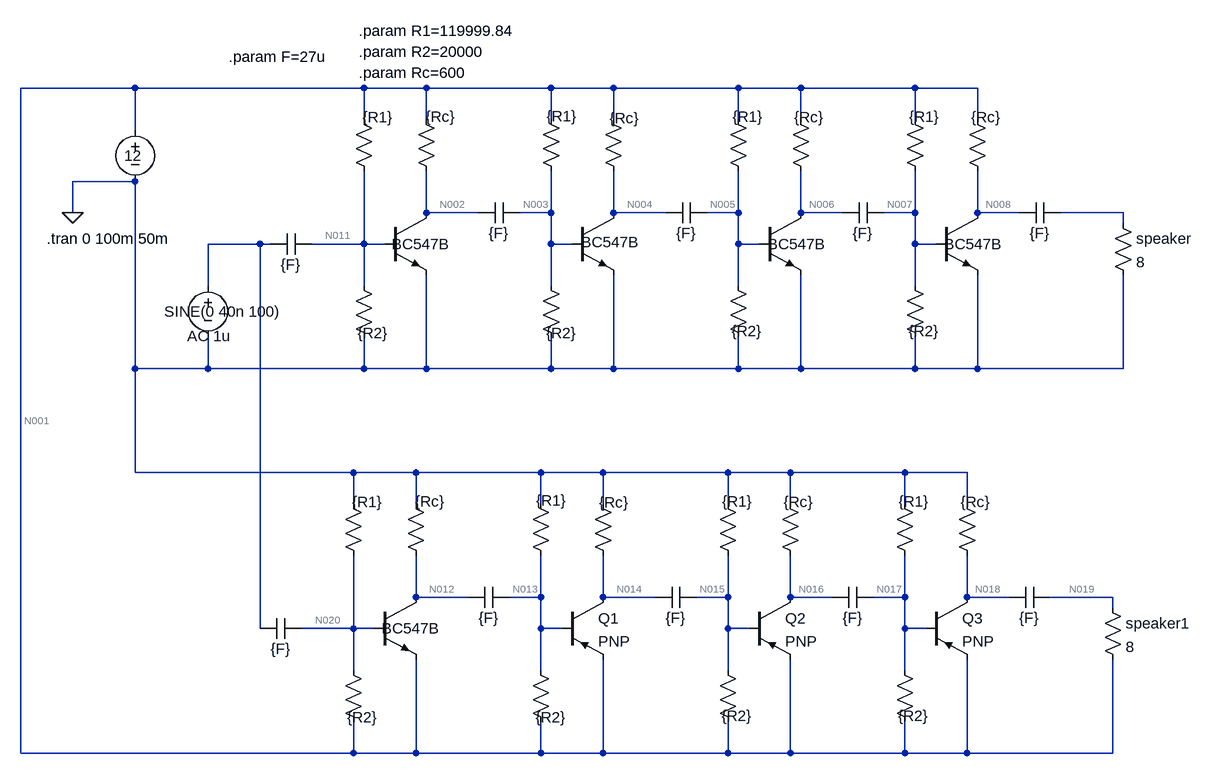
[diagram p0: schematic amplifier.asc]
amplifier.asc, the LTspice schematic file:
Version 4
SHEET 1 1988 1048
WIRE -336 16 -512 16
WIRE 16 16 -336 16
WIRE 112 16 16 16
WIRE 304 16 112 16
WIRE 400 16 304 16
WIRE 592 16 400 16
WIRE 688 16 592 16
WIRE 864 16 688 16
WIRE 960 16 864 16
WIRE 16 64 16 16
WIRE 112 64 112 16
WIRE 304 64 304 16
WIRE 400 64 400 16
WIRE 592 64 592 16
WIRE 688 64 688 16
WIRE 864 64 864 16
WIRE 960 64 960 16
WIRE -336 80 -336 16
WIRE -336 160 -432 160
WIRE -432 208 -432 160
WIRE 112 208 112 144
WIRE 192 208 112 208
WIRE 304 208 304 144
WIRE 304 208 256 208
WIRE 400 208 400 144
WIRE 480 208 400 208
WIRE 592 208 592 144
WIRE 592 208 544 208
WIRE 688 208 688 144
WIRE 752 208 688 208
WIRE 864 208 864 144
WIRE 864 208 816 208
WIRE 960 208 960 144
WIRE 1024 208 960 208
WIRE 1184 208 1088 208
WIRE 1184 224 1184 208
WIRE -144 256 -224 256
WIRE -128 256 -144 256
WIRE 16 256 16 144
WIRE 16 256 -64 256
WIRE 48 256 16 256
WIRE 304 256 304 208
WIRE 336 256 304 256
WIRE 592 256 592 208
WIRE 624 256 592 256
WIRE 864 256 864 208
WIRE 896 256 864 256
WIRE -224 320 -224 256
WIRE 16 320 16 256
WIRE 304 320 304 256
WIRE 592 320 592 256
WIRE 864 320 864 256
WIRE -336 448 -336 160
WIRE -224 448 -224 400
WIRE -224 448 -336 448
WIRE 16 448 16 400
WIRE 16 448 -224 448
WIRE 112 448 112 304
WIRE 112 448 16 448
WIRE 304 448 304 400
WIRE 304 448 112 448
WIRE 400 448 400 304
WIRE 400 448 304 448
WIRE 592 448 592 400
WIRE 592 448 400 448
WIRE 688 448 688 304
WIRE 688 448 592 448
WIRE 864 448 864 400
WIRE 864 448 688 448
WIRE 960 448 960 304
WIRE 960 448 864 448
WIRE 1184 448 1184 304
WIRE 1184 448 960 448
WIRE -336 608 -336 448
WIRE 0 608 -336 608
WIRE 96 608 0 608
WIRE 288 608 96 608
WIRE 384 608 288 608
WIRE 576 608 384 608
WIRE 672 608 576 608
WIRE 848 608 672 608
WIRE 944 608 848 608
WIRE 0 656 0 608
WIRE 96 656 96 608
WIRE 288 656 288 608
WIRE 384 656 384 608
WIRE 576 656 576 608
WIRE 672 656 672 608
WIRE 848 656 848 608
WIRE 944 656 944 608
WIRE 96 800 96 736
WIRE 176 800 96 800
WIRE 288 800 288 736
WIRE 288 800 240 800
WIRE 384 800 384 736
WIRE 464 800 384 800
WIRE 576 800 576 736
WIRE 576 800 528 800
WIRE 672 800 672 736
WIRE 736 800 672 800
WIRE 848 800 848 736
WIRE 848 800 800 800
WIRE 944 800 944 736
WIRE 1008 800 944 800
WIRE 1168 800 1072 800
WIRE 1168 816 1168 800
WIRE -144 848 -144 256
WIRE 0 848 0 736
WIRE 0 848 -80 848
WIRE 32 848 0 848
WIRE 288 848 288 800
WIRE 320 848 288 848
WIRE 576 848 576 800
WIRE 608 848 576 848
WIRE 848 848 848 800
WIRE 880 848 848 848
WIRE 0 912 0 848
WIRE 288 912 288 848
WIRE 576 912 576 848
WIRE 848 912 848 848
WIRE -512 1040 -512 16
WIRE 0 1040 0 992
WIRE 0 1040 -512 1040
WIRE 96 1040 96 896
WIRE 96 1040 0 1040
WIRE 288 1040 288 992
WIRE 288 1040 96 1040
WIRE 384 1040 384 896
WIRE 384 1040 288 1040
WIRE 576 1040 576 992
WIRE 576 1040 384 1040
WIRE 672 1040 672 896
WIRE 672 1040 576 1040
WIRE 848 1040 848 992
WIRE 848 1040 672 1040
WIRE 944 1040 944 896
WIRE 944 1040 848 1040
WIRE 1168 1040 1168 896
WIRE 1168 1040 944 1040
FLAG -432 208 0
SYMBOL npn 48 208 R0
WINDOW 0 56 32 Invisible 2
WINDOW 3 11 48 Left 2
SYMATTR InstName T1
SYMATTR Value BC547B
SYMBOL voltage -336 64 R0
WINDOW 0 24 16 Invisible 2
WINDOW 3 -17 56 Left 2
SYMATTR InstName V2
SYMATTR Value 12
SYMBOL res 0 48 R0
WINDOW 0 36 40 Invisible 2
WINDOW 3 14 13 Left 2
SYMATTR InstName R1
SYMATTR Value {R1}
SYMBOL res 0 304 R0
WINDOW 0 36 40 Invisible 2
WINDOW 3 6 89 Left 2
SYMATTR InstName R2
SYMATTR Value {R2}
SYMBOL res 96 48 R0
WINDOW 0 36 40 Invisible 2
WINDOW 3 15 12 Left 2
SYMATTR InstName Rc1
SYMATTR Value {Rc}
SYMBOL cap -128 272 R270
WINDOW 0 32 32 Invisible 2
WINDOW 3 0 32 VBottom 2
SYMATTR InstName C1
SYMATTR Value {F}
SYMBOL voltage -224 304 R0
WINDOW 123 -32 94 Left 2
WINDOW 3 -67 56 Left 2
WINDOW 0 24 16 Invisible 2
WINDOW 39 0 0 Left 0
SYMATTR Value2 AC 1u
SYMATTR Value SINE(0 40n 100)
SYMATTR InstName V1
SYMBOL res 1168 208 R0
SYMATTR InstName speaker
SYMATTR Value 8
SYMBOL cap 192 224 R270
WINDOW 0 32 32 Invisible 2
WINDOW 3 0 32 VBottom 2
SYMATTR InstName C2
SYMATTR Value {F}
SYMBOL npn 336 208 R0
WINDOW 0 56 32 Invisible 2
WINDOW 3 14 45 Left 2
SYMATTR InstName T2
SYMATTR Value BC547B
SYMBOL res 288 48 R0
WINDOW 0 36 40 Invisible 2
WINDOW 3 9 11 Left 2
SYMATTR InstName R3
SYMATTR Value {R1}
SYMBOL res 288 304 R0
WINDOW 0 36 40 Invisible 2
WINDOW 3 8 89 Left 2
SYMATTR InstName R4
SYMATTR Value {R2}
SYMBOL res 384 48 R0
WINDOW 0 36 40 Invisible 2
WINDOW 3 10 14 Left 2
SYMATTR InstName Rc2
SYMATTR Value {Rc}
SYMBOL cap 480 224 R270
WINDOW 0 32 32 Invisible 2
WINDOW 3 0 32 VBottom 2
SYMATTR InstName C3
SYMATTR Value {F}
SYMBOL npn 624 208 R0
WINDOW 0 56 32 Invisible 2
WINDOW 3 13 48 Left 2
SYMATTR InstName T3
SYMATTR Value BC547B
SYMBOL res 576 48 R0
WINDOW 0 36 40 Invisible 2
WINDOW 3 7 12 Left 2
SYMATTR InstName R5
SYMATTR Value {R1}
SYMBOL res 576 304 R0
WINDOW 0 36 40 Invisible 2
WINDOW 3 6 86 Left 2
SYMATTR InstName R6
SYMATTR Value {R2}
SYMBOL res 672 48 R0
WINDOW 0 36 40 Invisible 2
WINDOW 3 6 13 Left 2
SYMATTR InstName Rc3
SYMATTR Value {Rc}
SYMBOL cap 1024 224 R270
WINDOW 0 32 32 Invisible 2
WINDOW 3 0 32 VBottom 2
SYMATTR InstName C6
SYMATTR Value {F}
SYMBOL cap 752 224 R270
WINDOW 0 32 32 Invisible 2
WINDOW 3 0 32 VBottom 2
SYMATTR InstName C4
SYMATTR Value {F}
SYMBOL npn 896 208 R0
WINDOW 0 56 32 Invisible 2
WINDOW 3 13 48 Left 2
SYMATTR InstName T4
SYMATTR Value BC547B
SYMBOL res 848 48 R0
WINDOW 0 36 40 Invisible 2
WINDOW 3 7 12 Left 2
SYMATTR InstName R7
SYMATTR Value {R1}
SYMBOL res 848 304 R0
WINDOW 0 36 40 Invisible 2
WINDOW 3 6 86 Left 2
SYMATTR InstName R8
SYMATTR Value {R2}
SYMBOL res 944 48 R0
WINDOW 0 36 40 Invisible 2
WINDOW 3 6 13 Left 2
SYMATTR InstName Rc4
SYMATTR Value {Rc}
SYMBOL npn 32 800 R0
WINDOW 0 56 32 Invisible 2
WINDOW 3 11 48 Left 2
SYMATTR InstName T5
SYMATTR Value BC547B
SYMBOL res -16 640 R0
WINDOW 0 36 40 Invisible 2
WINDOW 3 14 13 Left 2
SYMATTR InstName R9
SYMATTR Value {R1}
SYMBOL res -16 896 R0
WINDOW 0 36 40 Invisible 2
WINDOW 3 6 89 Left 2
SYMATTR InstName R10
SYMATTR Value {R2}
SYMBOL res 80 640 R0
WINDOW 0 36 40 Invisible 2
WINDOW 3 15 12 Left 2
SYMATTR InstName Rc5
SYMATTR Value {Rc}
SYMBOL cap -144 864 R270
WINDOW 0 32 32 Invisible 2
WINDOW 3 0 32 VBottom 2
SYMATTR InstName C5
SYMATTR Value {F}
SYMBOL res 1152 800 R0
SYMATTR InstName speaker1
SYMATTR Value 8
SYMBOL cap 176 816 R270
WINDOW 0 32 32 Invisible 2
WINDOW 3 0 32 VBottom 2
SYMATTR InstName C7
SYMATTR Value {F}
SYMBOL res 272 640 R0
WINDOW 0 36 40 Invisible 2
WINDOW 3 9 11 Left 2
SYMATTR InstName R11
SYMATTR Value {R1}
SYMBOL res 272 896 R0
WINDOW 0 36 40 Invisible 2
WINDOW 3 8 89 Left 2
SYMATTR InstName R12
SYMATTR Value {R2}
SYMBOL res 368 640 R0
WINDOW 0 36 40 Invisible 2
WINDOW 3 10 14 Left 2
SYMATTR InstName Rc6
SYMATTR Value {Rc}
SYMBOL cap 464 816 R270
WINDOW 0 32 32 Invisible 2
WINDOW 3 0 32 VBottom 2
SYMATTR InstName C8
SYMATTR Value {F}
SYMBOL res 560 640 R0
WINDOW 0 36 40 Invisible 2
WINDOW 3 7 12 Left 2
SYMATTR InstName R13
SYMATTR Value {R1}
SYMBOL res 560 896 R0
WINDOW 0 36 40 Invisible 2
WINDOW 3 6 86 Left 2
SYMATTR InstName R14
SYMATTR Value {R2}
SYMBOL res 656 640 R0
WINDOW 0 36 40 Invisible 2
WINDOW 3 6 13 Left 2
SYMATTR InstName Rc7
SYMATTR Value {Rc}
SYMBOL cap 1008 816 R270
WINDOW 0 32 32 Invisible 2
WINDOW 3 0 32 VBottom 2
SYMATTR InstName C9
SYMATTR Value {F}
SYMBOL cap 736 816 R270
WINDOW 0 32 32 Invisible 2
WINDOW 3 0 32 VBottom 2
SYMATTR InstName C10
SYMATTR Value {F}
SYMBOL res 832 640 R0
WINDOW 0 36 40 Invisible 2
WINDOW 3 7 12 Left 2
SYMATTR InstName R15
SYMATTR Value {R1}
SYMBOL res 832 896 R0
WINDOW 0 36 40 Invisible 2
WINDOW 3 6 86 Left 2
SYMATTR InstName R16
SYMATTR Value {R2}
SYMBOL res 928 640 R0
WINDOW 0 36 40 Invisible 2
WINDOW 3 6 13 Left 2
SYMATTR InstName Rc8
SYMATTR Value {Rc}
SYMBOL pnp 320 800 R0
SYMATTR InstName Q1
SYMBOL pnp 608 800 R0
SYMATTR InstName Q2
SYMBOL pnp 880 800 R0
SYMATTR InstName Q3
TEXT -472 248 Left 2 !.tran 0 100m 50m
TEXT 8 -8 Left 2 !.param Rc=600
TEXT 8 -72 Left 2 !.param R1=119999.84
TEXT 8 -40 Left 2 !.param R2=20000
TEXT -192 -32 Left 2 !.param F=27u

The netlist it stands for:
* amplifier.asc
Q§T1 N002 N011 0 0 BC547B
V2 N001 0 12
R1 N001 N011 {R1}
R2 N011 0 {R2}
Rc1 N001 N002 {Rc}
C1 N010 N011 {F}
V1 N010 0 SINE(0 40n 100) AC 1u
R§speaker N009 0 8
C2 N002 N003 {F}
Q§T2 N004 N003 0 0 BC547B
R3 N001 N003 {R1}
R4 N003 0 {R2}
Rc2 N001 N004 {Rc}
C3 N004 N005 {F}
Q§T3 N006 N005 0 0 BC547B
R5 N001 N005 {R1}
R6 N005 0 {R2}
Rc3 N001 N006 {Rc}
C6 N008 N009 {F}
C4 N006 N007 {F}
Q§T4 N008 N007 0 0 BC547B
R7 N001 N007 {R1}
R8 N007 0 {R2}
Rc4 N001 N008 {Rc}
Q§T5 N012 N020 N001 0 BC547B
R9 0 N020 {R1}
R10 N020 N001 {R2}
Rc5 0 N012 {Rc}
C5 N010 N020 {F}
R§speaker1 N019 N001 8
C7 N012 N013 {F}
R11 0 N013 {R1}
R12 N013 N001 {R2}
Rc6 0 N014 {Rc}
C8 N014 N015 {F}
R13 0 N015 {R1}
R14 N015 N001 {R2}
Rc7 0 N016 {Rc}
C9 N018 N019 {F}
C10 N016 N017 {F}
R15 0 N017 {R1}
R16 N017 N001 {R2}
Rc8 0 N018 {Rc}
Q1 N014 N013 N001 0 PNP
Q2 N016 N015 N001 0 PNP
Q3 N018 N017 N001 0 PNP
.model NPN NPN
.model PNP PNP
.lib standard.bjt
.tran 0 100m 50m
.param Rc=600
.param R1=119999.84
.param R2=20000
.param F=27u
.backanno
.end

* Results of the author's LTspice run, read from the files saved beside the schematic
* Operating Point, zero values left out:
*   V(n002) = 2.773 V
*   V(n011) = 718.8 mV
*   V(n001) = 12 V
*   V(n003) = 718.8 mV
*   V(n004) = 2.773 V
*   V(n005) = 718.8 mV
*   V(n006) = 2.773 V
*   V(n008) = 2.773 V
*   V(n007) = 718.8 mV
*   V(n012) = 2.483 V
*   V(n020) = 3.15 V
*   V(n019) = 12 V
*   V(n013) = 11.18 V
*   V(n014) = 3.14 V
*   V(n015) = 11.18 V
*   V(n016) = 3.14 V
*   V(n018) = 3.14 V
*   V(n017) = 11.18 V
*   Ic(Q3) = -5.234 mA
*   Ib(Q3) = -52.34 µA
*   Ie(Q3) = 5.286 mA
*   Ic(Q2) = -5.234 mA
*   Ib(Q2) = -52.34 µA
*   Ie(Q2) = 5.286 mA
*   Ic(Q1) = -5.234 mA
*   Ib(Q1) = -52.34 µA
*   Ie(Q1) = 5.286 mA
*   Ic(T5) = -4.139 mA
*   Ib(T5) = 416.3 µA
*   Ie(T5) = 3.723 mA
*   Ic(T4) = 15.38 mA
*   Ib(T4) = 58.07 µA
*   Ie(T4) = -15.44 mA
*   Ic(T3) = 15.38 mA
*   Ib(T3) = 58.07 µA
*   Ie(T3) = -15.44 mA
*   Ic(T2) = 15.38 mA
*   Ib(T2) = 58.07 µA
*   Ie(T2) = -15.44 mA
*   Ic(T1) = 15.38 mA
*   Ib(T1) = 58.07 µA
*   Ie(T1) = -15.44 mA
*   I(Rc8) = -5.234 mA
*   I(R16) = -40.85 µA
*   I(R15) = -93.19 µA
*   I(Rc7) = -5.234 mA
*   I(R14) = -40.85 µA
*   I(R13) = -93.19 µA
*   I(Rc6) = -5.234 mA
*   I(R12) = -40.85 µA
*   I(R11) = -93.19 µA
*   I(Rc5) = -4.139 mA
*   I(R10) = -442.5 µA
*   I(R9) = -26.25 µA
*   I(Rc4) = 15.38 mA
*   I(R8) = 35.94 µA
*   I(R7) = 94.01 µA
*   I(Rc3) = 15.38 mA
*   I(R6) = 35.94 µA
*   I(R5) = 94.01 µA
*   I(Rc2) = 15.38 mA
*   I(R4) = 35.94 µA
*   I(R3) = 94.01 µA
*   I(Rc1) = 15.38 mA
*   I(R2) = 35.94 µA
*   I(R1) = 94.01 µA
*   I(V2) = -82.03 mA
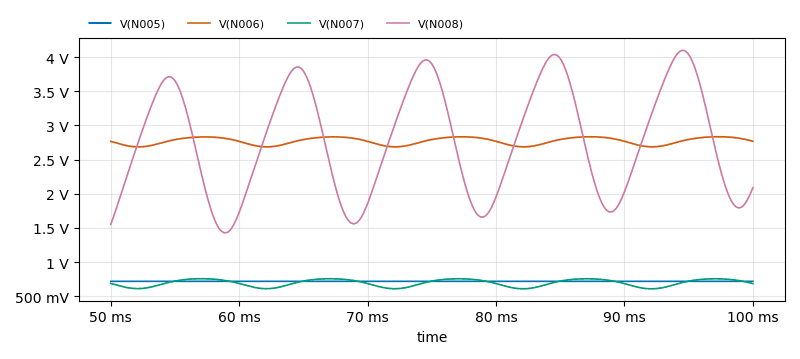
[diagram p1: Transient Analysis of amplifier.asc, plotted from the saved traces]
* Transient Analysis, 1 run:
*   V(N005): min 718.3 mV, max 719.4 mV, average 718.8 mV, rms 718.8 mV, last 719 mV
*   V(N006): min 2.687 V, max 2.836 V, average 2.772 V, rms 2.772 V, last 2.769 V
*   V(N007): min 609.5 mV, max 757 mV, average 694.4 mV, rms 696.4 mV, last 685.5 mV
*   V(N008): min 1.429 V, max 4.1 V, average 2.776 V, rms 2.89 V, last 2.09 V